# EasyEDA Pro project 遥控器PCB设计.eprj, schematic 遥控器_v2_3
Board Name: 遥控器_V2_4通道简化版; Create Date: 2025-07-19; Page Name: P1; Project Name: 遥控器PCB设计; Schematic Name: 遥控器_v2_3; Update Date: 2025-08-31; Company: 嘉立创EDA; Page Size: A4; Version: V1.0
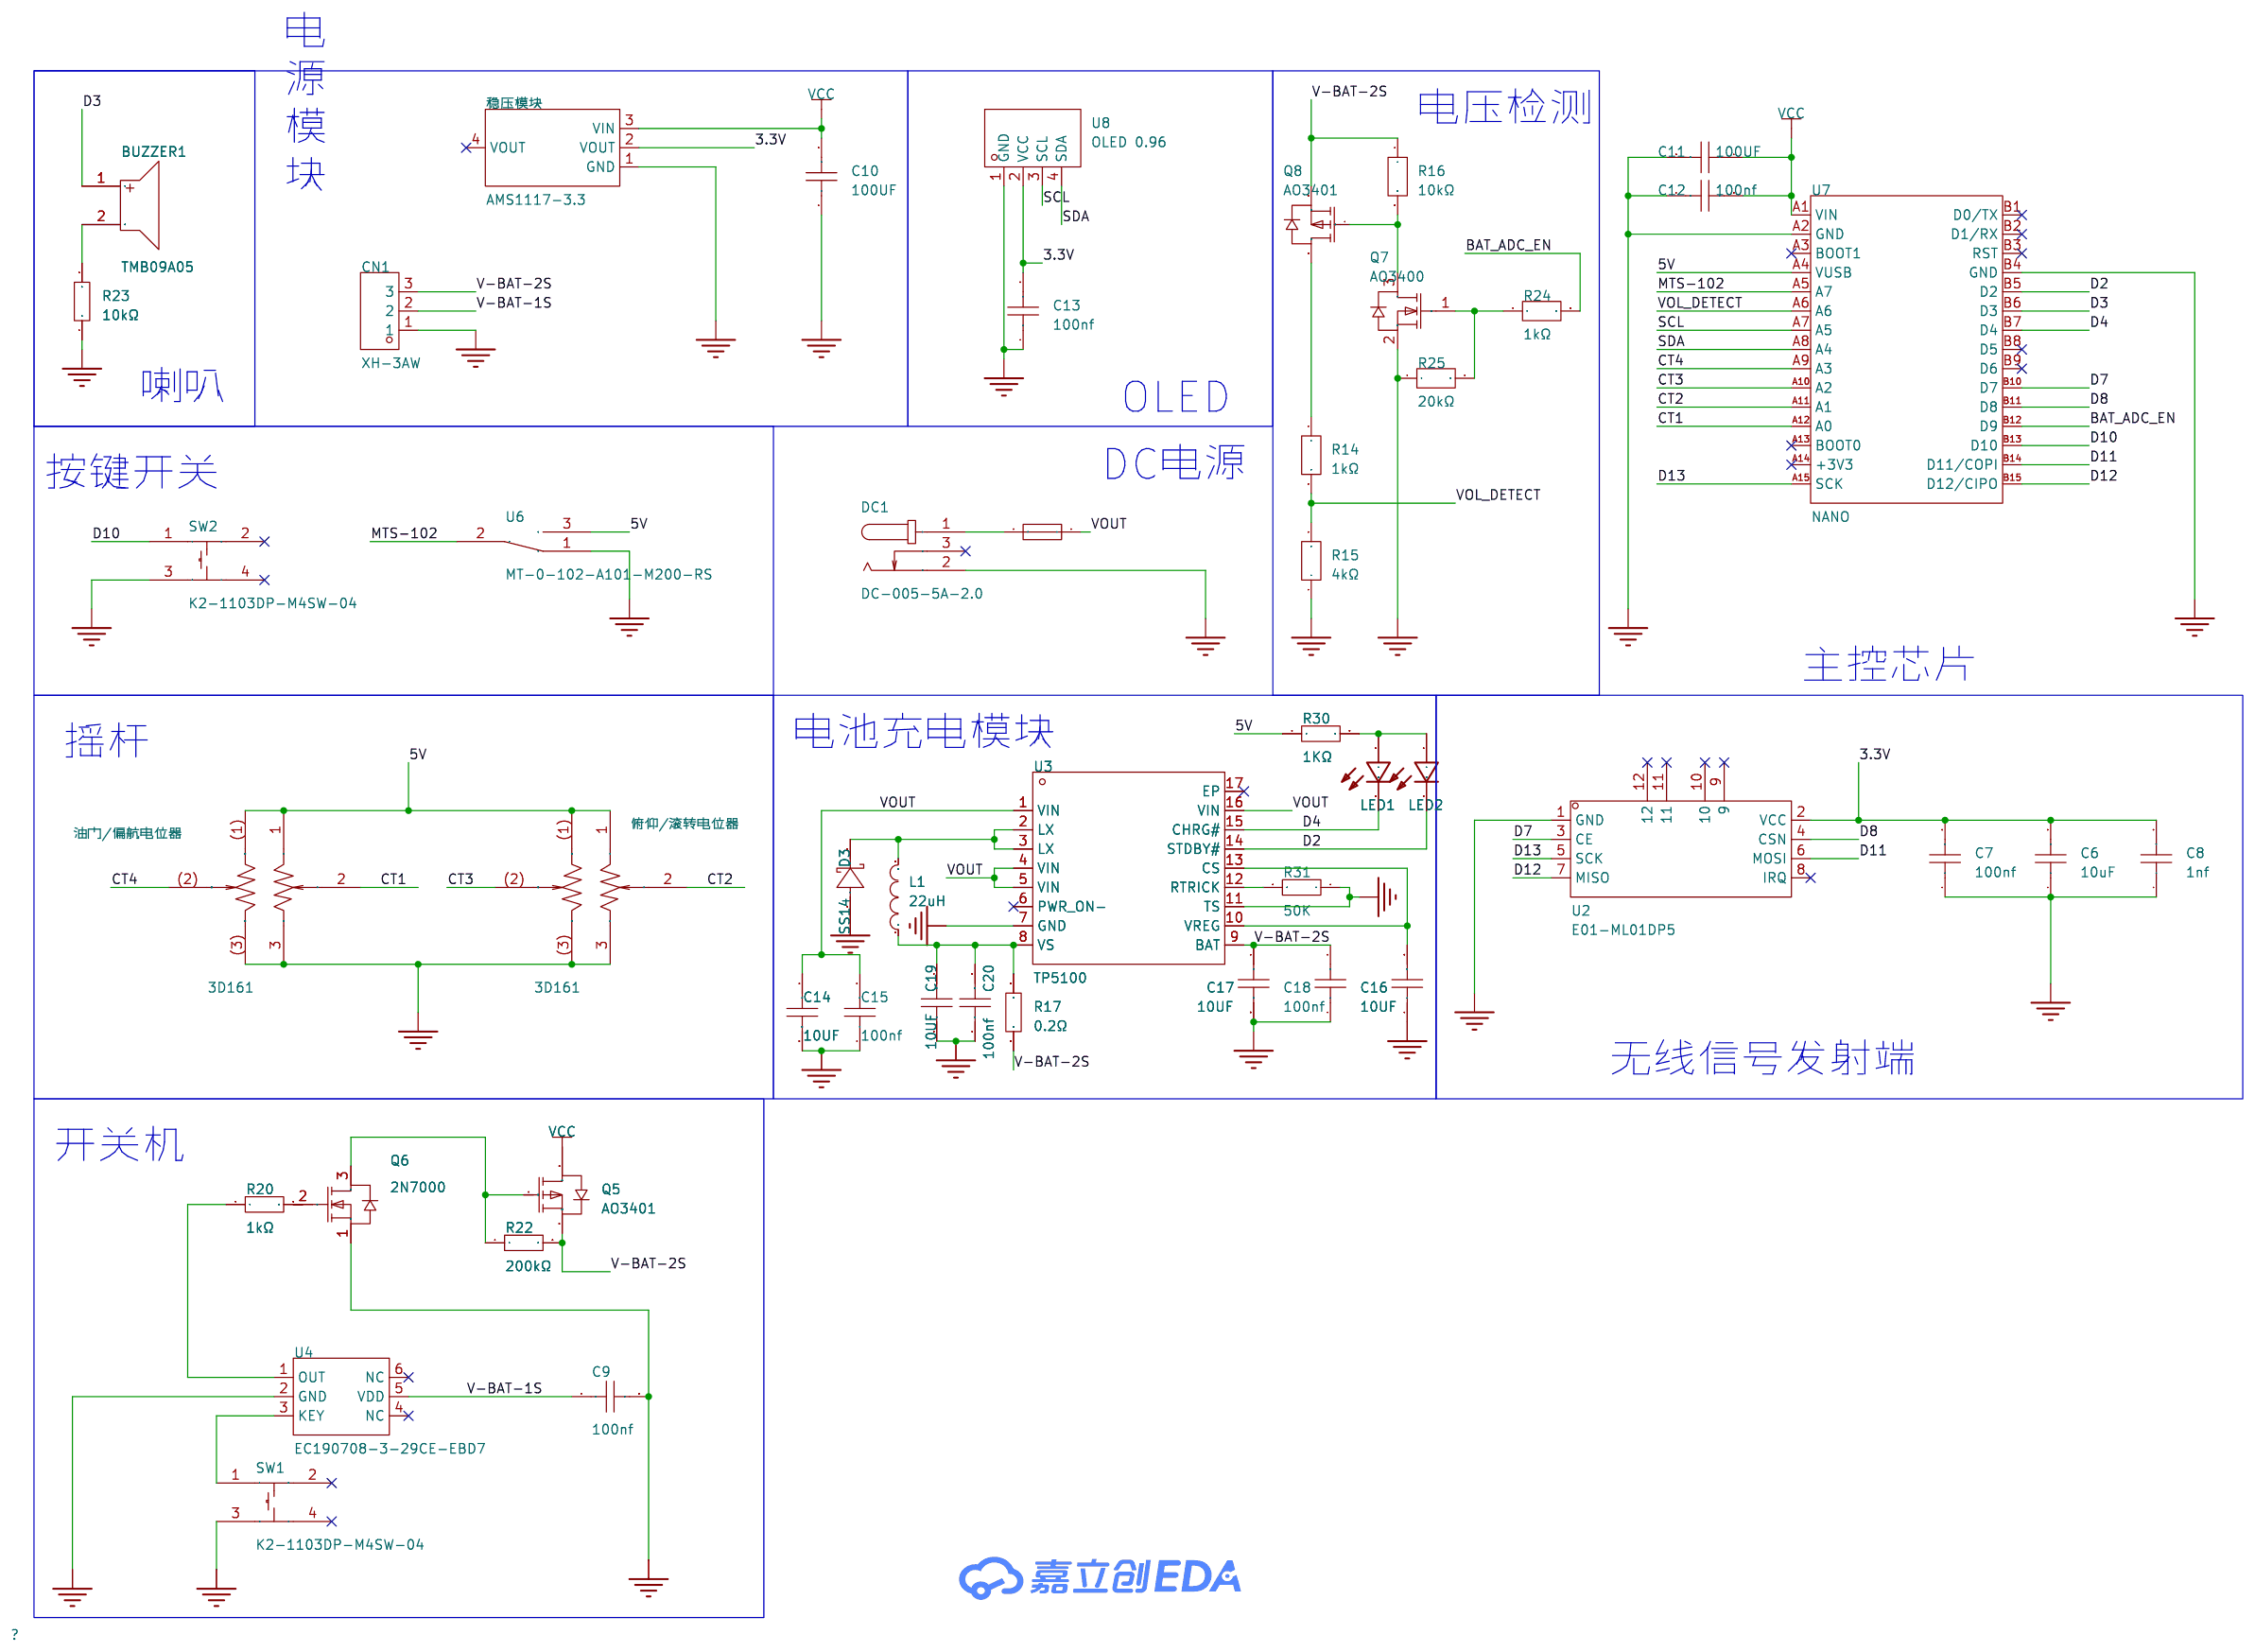
[diagram p9: schematic sheet]

## Parts
BUZZER1  TMB09A05  [BUZ-TH_BD9.0-P5.00-D0.6-L-FD]
C6  10uF  [C1206]
C7  100nf  [C1206]
C8  1nf  [C1206]
C9  100nf  [C1206]
C10  100UF  [C1210]
C11  100UF  [C1210]
C12  100nf  [C1206]
C13  100nf  [C1206]
C14  10UF  [C1210]
C15  100nf  [C1206]
C16  10UF  [C1206]
C17  10UF  [C1210]
C18  100nf  [C1206]
C19  10UF  [C1210]
C20  100nf  [C1206]
CN1  XH-3AW  [CONN-TH_3P-P2.54_HCTL_XH-3AW]
D3  SS14  [SMA_L4.3-W2.6-LS5.0-FD]
DC1  DC-005-5A-2.0  [DC-IN-TH_DC-005-5A-2.0]
F1  SMD1206  [F1206]
L1  22uH  [IND-SMD_L12.0-W12.0_YPRH120X]
LED1  19-217/BHC-ZL1M2RY/3T  [LED0603-R-RD]
LED2  19-217/BHC-ZL1M2RY/3T  [LED0603-R-RD]
Q5  AO3401  [SOT-23-3_L2.9-W1.4-P1.90-LS2.6-BR]
Q6  2N7000  [TO-92-3_L4.9-W3.7-P1.27-L]
Q7  AO3400  [SOT-23_L2.9-W1.3-P1.90-LS2.4-BR]
Q8  AO3401  [SOT-23-3_L2.9-W1.4-P1.90-LS2.6-BR]
R14  1kΩ  [R0603]
R15  4kΩ  [R0603]
R16  10kΩ  [R0603]
R17  0.2Ω  [R1206]
R20  1kΩ  [R0603]
R22  200kΩ  [R0603]
R23  10kΩ  [R0603]
R24  1kΩ  [R0603]
R25  20kΩ  [R0603]
R30  1KΩ  [R1206]
R31  50K  [R1206]
SW1  K2-1103DP-M4SW-04  [SW-TH_4P-L12.0-W12.0-P5.00-LS12.5_TC-1103XX]
SW2  K2-1103DP-M4SW-04  [SW-TH_4P-L12.0-W12.0-P5.00-LS12.5_TC-1103XX]
U2  E01-ML01DP5  [WIRELM-TH_E01-ML01DP5]
U3  TP5100  [TQFN-16_L4.0-W4.0-P0.65-BL-EP]
U4  EC190708-3-29CE-EBD7  [SOT-23-6_L2.9-W1.6-P0.95-LS2.9-BL]
U6  MT-0-102-A101-M200-RS  [SW-TH_MT-0-103-A101-M200-RS]
U7  NANO  [COMM-TH_ABX00092]
U8  OLED 0.96  [OLED-TH_L27.8-W27.2-P2.54_C9900033791]
俯仰/滚转电位器  3D161  [SW-TH_3D161]
油门/偏航电位器  3D161  [SW-TH_3D161]
稳压模块  AMS1117-3.3  [SOT-223-3_L6.5-W3.4-P2.30-LS7.0-BR]

## Library data of the parts
BUZZER1 = TMB09A05: LCSC Part Name: 蜂鸣器; Supplier Part: C49246939; Manufacturer: XHXDZ(兴华鑫); Supplier Footprint: 插件,D9xL5.5mm; JLCPCB Part Class: 扩展库; Datasheet: https://atta.szlcsc.com/upload/public/pdf/source/20250627/50F92DDAD8206418B87DF1B4D6B075D4.pdf; Supplier: LCSC
C6-C9 C12 C13 C15 C16 C18 C20 = HGC1206R5106K500NSPJ: LCSC Part Name: 10uF ±10% 50V; Supplier Part: C7432781; Manufacturer: Chinocera(华瓷); Supplier Footprint: 1206; JLCPCB Part Class: 扩展库; Datasheet: https://atta.szlcsc.com/upload/public/pdf/source/20240320/FAC3FEC40A78BC5CCCE96C232A94D860.pdf; Supplier: LCSC; Tolerance: ±10%; Voltage Rating: 50V; Temperature Coefficient: X5R
C10 C11 C14 C17 C19 = HGC1210R5476M250NSVK: LCSC Part Name: 47uF ±20% 25V; Supplier Part: C7432791; Manufacturer: Chinocera(华瓷); Supplier Footprint: 1210; JLCPCB Part Class: 扩展库; Datasheet: https://atta.szlcsc.com/upload/public/pdf/source/20240320/FAC3FEC40A78BC5CCCE96C232A94D860.pdf; Supplier: LCSC; Tolerance: ±20%; Voltage Rating: 25V; Temperature Coefficient: X5R
CN1 = XH-3AW_C2908612: LCSC Part Name: 1x3P 间距:2.54mm 弯插 系列:XH; Supplier Part: C2908612; Manufacturer: HCTL(华灿天禄); Supplier Footprint: 弯插,P=2.5mm; JLCPCB Part Class: 扩展库; Datasheet: https://atta.szlcsc.com/upload/public/pdf/source/20230711/B565BAF3B11666EF6B81B3605408F2BD.pdf; Supplier: LCSC; Pins Structure: 1x3P; Pitch: 2.54mm; Mounting Style: 弯插; Reference Series: XH; Number of Pins: 3P; Number of Rows: 1; Number of PINs Per Row: 3; Current Rating (Max): 3A; Contact Material: 黄铜; Contact Plating: 锡; Operating Temperature Range: -25℃~+85℃
D3 = SS14_C7420316: LCSC Part Name: 电压:40V 电流:1A; Supplier Part: C7420316; Manufacturer: 宏迦橙; Supplier Footprint: SMA(DO-214AC); JLCPCB Part Class: 扩展库; Datasheet: https://atta.szlcsc.com/upload/public/pdf/source/20230828/C73881E3299A0827586C2B1C18B17A53.pdf; Supplier: LCSC; Diode Configuration: 独立式; Forward Voltage (Vf@If): 550mV@1.0A; Reverse Voltage (Vr): 40V; Rectified Current: 1A; Reverse Leakage Current (Ir): 200uA@40V
DC1 = DC-005-5A-2.0: LCSC Part Name: DC电源插座 内径:2mm 外径:6.2mm; Supplier Part: C381116; Manufacturer: XKB Connection(中国星坤); Supplier Footprint: 插件; JLCPCB Part Class: 扩展库; Datasheet: https://atta.szlcsc.com/upload/public/pdf/source/20211015/707A35F7AB6E89C57AAB641950105BB7.pdf; Supplier: LCSC; Connector Type: DC电源插座; Mounting Style: 弯插; Inside Contact Diameter: 2mm; Outside Contact Diameter: 6.2mm; Current Rating (Max): 5A; Voltage Rating (Max): 24V; Operating Temperature Range: -20℃~+70℃
F1 = SMD1206-150-16: Supplier Part: C46641031; Manufacturer: 宏嘉诚; Supplier Footprint: 1206; JLCPCB Part Class: 扩展库; Datasheet: https://atta.szlcsc.com/upload/public/pdf/source/20250414/5AC46D2F961B725C9DB708C91B04DBEC.pdf; Supplier: LCSC; Voltage - Max: 16V; Current - Max: 40A; Hold Current: 1.5A; Trip Current: 3A; Power Dissipation: 1W; Resistance - Initial (Ri) (Min): 25mΩ; Resistance - Post Trip (R1) (Max): 130mΩ; Time to Trip(Max): 300ms
L1 = YPRH1207-220M: LCSC Part Name: 22uH ±20%; Supplier Part: C339950; Manufacturer: YJYCOIN(益嘉源); Supplier Footprint: SMD,12x12mm; JLCPCB Part Class: 扩展库; Datasheet: https://atta.szlcsc.com/upload/public/pdf/source/20200623/C339950_CB2CAFE108BC5DE837AA8F39C29DA454.pdf; Supplier: LCSC; Tolerance: ±20%; Rated Current: 3.6A; DC Resistance (DCR): 43mΩ
LED1 LED2 = 19-217/BHC-ZL1M2RY/3T: Supplier: LCSC; Manufacturer: EVERLIGHT; image: //image.lceda.cn/szlcsc/C72041.jpg; Supplier Part: C72041; JLCPCB Part Class: Basic; spicePre: L
Q5 Q8 = AO3401_C727156: LCSC Part Name: 1个P沟道 耐压:30V 电流:4.2A; Supplier Part: C727156; Manufacturer: TWGMC(台湾迪嘉); Supplier Footprint: SOT-23; JLCPCB Part Class: 扩展库; Datasheet: https://atta.szlcsc.com/upload/public/pdf/source/20200827/C727156_6E081BBEEFBC6B8FEE164CB196B0AF30.pdf; Supplier: LCSC; Type: 1个P沟道; Drain Source Voltage (Vdss): 30V; Continuous Drain Current (Id): 4.2A; Drain Source On Resistance (RDS(on)@Vgs,Id): 65mΩ@10V,4.2A; Power Dissipation (Pd): 350mW; Gate Threshold Voltage (Vgs(th)@Id): 1.3V@250uA; Input Capacitance (Ciss@Vds): 954pF; Reverse Transfer Capacitance (Crss@Vds): 77pF; Operating Temperature: -55℃~+150℃
Q6 = 2N7000: LCSC Part Name: 1个N沟道 耐压:60V 电流:200mA; Supplier Part: C232838; Manufacturer: onsemi(安森美); Supplier Footprint: TO-92-3; JLCPCB Part Class: 扩展库; Datasheet: https://atta.szlcsc.com/upload/public/pdf/source/20221020/6B07E43F0B4B9B39AB447A9A1885F5BD.pdf; Supplier: LCSC; Type: 1个N沟道; Drain Source Voltage (Vdss): 60V; Continuous Drain Current (Id): 200mA; Drain Source On Resistance (RDS(on)@Vgs,Id): 5Ω@10V,500mA; Power Dissipation (Pd): 400mW; Gate Threshold Voltage (Vgs(th)@Id): 3V@1mA
Q7 = AO3400_C2938367: LCSC Part Name: 1个N沟道 耐压:30V 电流:5.8A; Supplier Part: C2938367; Manufacturer: GOODWORK(固得沃克); Supplier Footprint: SOT-23; JLCPCB Part Class: 扩展库; Datasheet: https://atta.szlcsc.com/upload/public/pdf/source/20240805/AF56525E67E43DBB802F95DDDF058BE9.pdf; Supplier: LCSC; Type: 1个N沟道; Drain to Source Voltage: 30V; Current - Continuous Drain(Id): 5.8A; RDS(on): 52mΩ@2.5V,4A; Pd - Power Dissipation: 1.5W; Gate Threshold Voltage (Vgs(th)@Id): 700mV; Input Capacitance(Ciss@Vds): 1.05nF; Reverse Transfer Capacitance (Crss@Vds): 77pF; Operating Temperature: -55℃~+150℃
R14 = FRC0603F1001TS: 电阻类型:厚膜电阻;阻值:1kΩ;精度:±1%;功率:100mW;最大工作电压:75V;温度系数:±100ppm/℃;; LCSC Part Name: 1kΩ ±1% 100mW 厚膜电阻; Supplier Part: C2907002; Manufacturer: FOJAN(富捷); Supplier Footprint: 0603; JLCPCB Part Class: 扩展库; Datasheet: https://atta.szlcsc.com/upload/public/pdf/source/20211221/925EC7D7225764EE0046F22065062C87.pdf; Supplier: LCSC; Type: 厚膜电阻; Tolerance: ±1%; Power(Watts): 100mW; Overload Voltage (Max): 75V; Temperature Coefficient: ±100ppm/℃; Operating Temperature Range: -55℃~+155℃
R15 = ARG03FTC4001N: 电阻类型:薄膜电阻;阻值:4kΩ;精度:±1%;; LCSC Part Name: 4kΩ ±1%; Supplier Part: C2984443; Manufacturer: Viking(光颉); Supplier Footprint: 0603; JLCPCB Part Class: 扩展库; Datasheet: https://atta.szlcsc.com/upload/public/pdf/source/20200117/C485675_99063924B4564AF910B7BE66DA8EFA49.pdf; Supplier: LCSC; Type: 薄膜电阻; Tolerance: ±1%
R16 R24 R25 = FRC0603J103 TS: 电阻类型:厚膜电阻;阻值:10kΩ;精度:±5%;功率:100mW;工作电压:75V;温度系数:±100ppm/℃;; LCSC Part Name: 10kΩ ±5% 100mW 厚膜电阻; Supplier Part: C2930027; Manufacturer: FOJAN(富捷); Supplier Footprint: 0603; JLCPCB Part Class: 扩展库; Datasheet: https://atta.szlcsc.com/upload/public/pdf/source/20211221/925EC7D7225764EE0046F22065062C87.pdf; Supplier: LCSC; Type: 厚膜电阻; Tolerance: ±5%; Power(Watts): 100mW; Voltage-Supply(Max): 75V; Temperature Coefficient: ±100ppm/℃; Operating Temperature: -55℃~+155℃
R17 R30 R31 = 1206W4F1002T5E: LCSC Part Name: 10kΩ ±1% 250mW 厚膜电阻; Supplier Part: C17902; Manufacturer: UNI-ROYAL(厚声); Supplier Footprint: 1206; JLCPCB Part Class: 基础库; Datasheet: https://atta.szlcsc.com/upload/public/pdf/source/20200306/C422600_1E6D84923E4A46A82E41ADD87F860B5C.pdf; Supplier: LCSC; Type: 厚膜电阻; Tolerance: ±1%; Power(Watts): 250mW; Overload Voltage (Max): 200V; Temperature Coefficient: ±100ppm/℃; Operating Temperature Range: -55℃~+155℃
R20 R22 R23 = 0603WAF1002T5E: LCSC Part Name: 厚膜电阻 10kΩ ±1% 100mW; Supplier Part: C25804; Manufacturer: UNI-ROYAL(厚声); Supplier Footprint: 0603; JLCPCB Part Class: 基础库; Datasheet: https://atta.szlcsc.com/upload/public/pdf/source/20200306/C422600_1E6D84923E4A46A82E41ADD87F860B5C.pdf; Supplier: LCSC; Type: 厚膜电阻; Tolerance: ±1%; Power(Watts): 100mW; Voltage-Supply(Max): 75V; Temperature Coefficient: ±100ppm/℃; Operating Temperature: -55℃~+155℃
SW1 SW2 = K2-1103DP-M4SW-04_C136702: Supplier Part: C136702; Supplier Footprint: 12x12mm; JLCPCB Part Class: 扩展库; Supplier: LCSC
U2 = E01-ML01DP5: Supplier Part: C97339; Manufacturer: EBYTE(亿佰特); Supplier Footprint: 插件; JLCPCB Part Class: 扩展库; Datasheet: https://atta.szlcsc.com/upload/public/pdf/source/20170306/1488794685960.pdf; Supplier: LCSC
U3 = TP5100: Supplier Part: C379389; Manufacturer: TOPPOWER(南京拓微); Supplier Footprint: TQFN-16-EP(4x4); JLCPCB Part Class: 扩展库; Datasheet: https://atta.szlcsc.com/upload/public/pdf/source/20230625/310531CA6E48A76C009AF7A61C581768.pdf; Supplier: LCSC
U4 = EC190708-3-29CE-EBD7: Supplier Part: C9900183753; Supplier Footprint: SOT23-6; Supplier: LCSC
U6 = MT-0-102-A101-M200-RS: LCSC Part Name: 小型钮子三脚二档 五件套; Supplier Part: C1788492; Manufacturer: YUEN FUNG(源丰); Supplier Footprint: 插件; JLCPCB Part Class: 扩展库; Datasheet: https://atta.szlcsc.com/upload/public/pdf/source/20230720/8E5C36EFDF374AE4FF4AC09DB233CE0E.pdf; Supplier: LCSC; Circuit: 单刀双掷; Switch Length: 13mm; Switch Width: 8mm; Switch Height: 28.6mm; Contact Current: 5A; Voltage Rating (AC): 125V; Actuator Type: 圆柱钮柄; Pin Style: 焊片; Mounting Style: 直插; Operating Temperature: -25℃~+85℃
U7 = ABX00092: Supplier Part: C22392566; Manufacturer: arduino; JLCPCB Part Class: 扩展库; Datasheet: https://atta.szlcsc.com/upload/public/pdf/source/20240508/B4DB31292A327EFF3440EB84C8D7CAB2.pdf; Supplier: LCSC
U8 = HS96L03W2C03: 主控芯片:SSD1315;接口类型:I2C;尺寸(inch):0.96;像素分辨率:128x64;; LCSC Part Name: 0.96寸OLED显示屏窄白光IIC; Supplier Part: C5248080; Manufacturer: HS(汉昇); JLCPCB Part Class: 扩展库; Datasheet: https://atta.szlcsc.com/upload/public/pdf/source/20230627/763D01F79A90007632F098068C7C8AD9.pdf; Supplier: LCSC; Main Control Chip: SSD1315; Interface Type: I2C; Size: 0.96; Pixel Resolution: 128x64; Operating Temperature: -40℃~+70℃
俯仰/滚转电位器 油门/偏航电位器 = 3D161: 摇杆  多向; LCSC Part Name: 3D161  3D摇杆 自恢复; Supplier Part: C92593; Manufacturer: 韩国韩荣; Supplier Footprint: 插件,16x16mm; JLCPCB Part Class: 扩展库; Datasheet: https://atta.szlcsc.com/upload/public/pdf/source/20170523/1495534045704.pdf; Supplier: LCSC
稳压模块 = AMS1117-3.3_C6186: 输出类型:固定;工作电压:-;输出电压:3.3V;输出电流:1A;电源纹波抑制比(PSRR):72dB@(120Hz);输出极性:正极;; LCSC Part Name: 输出3.3V 1A; Supplier Part: C6186; Manufacturer: AMS; Supplier Footprint: SOT-223; JLCPCB Part Class: Basic Part; Datasheet: https://atta.szlcsc.com/upload/public/pdf/source/20180727/C6186_7A095716F0823C02F1997A905E26C086.pdf; Supplier: LCSC; Output Type: 固定; Output Voltage: 3.3V; Output Current: 1A; Power Supply Rejection Ratio (PSRR): 72dB@(120Hz); Voltage Dropout: 1.3V@(800mA); Features: 过流保护(OCP)；热关断(TSD); Output Configuration: 正极; Number of Outputs: 1

## Nets
3.3V: C6.2 C7.2 C8.2 C13.2 U2.2(VCC) U8.2(VCC) 稳压模块.2(VOUT)
5V: R30.1 U6.3 U7.A4(VUSB) 俯仰/滚转电位器.1 俯仰/滚转电位器.(1) 油门/偏航电位器.1 油门/偏航电位器.(1)
GND: C6.1 C7.1 C8.1 C9.2 C10.1 C11.2 C12.1 C13.1 C14.2 C15.1 C16.1 C17.2 C18.1 C19.2 C20.1 CN1.1 D3.1(A) DC1.2 Q6.1(S) Q7.2(S) R15.1 R23.1 R25.1 R31.1 SW1.3 SW2.3 U2.1(GND) U3.7(GND) U3.11(TS) U4.2(GND) U6.1 U7.A2(GND) U7.B4(GND) U8.1(GND) 俯仰/滚转电位器.3 俯仰/滚转电位器.(3) 油门/偏航电位器.3 油门/偏航电位器.(3) 稳压模块.1(GND)
VCC: C10.2 C11.1 C12.2 Q5.3(D) U7.A1(VIN) 稳压模块.3(VIN)
BAT_ADC_EN: R24.2 U7.B12(D9)
CT1: U7.A12(A0) 油门/偏航电位器.2
CT2: U7.A11(A1) 俯仰/滚转电位器.2
CT3: U7.A10(A2) 俯仰/滚转电位器.(2)
CT4: U7.A9(A3) 油门/偏航电位器.(2)
D2: LED2.2(C) U3.14(STDBY#) U7.B5(D2)
D3: BUZZER1.1 U7.B6(D3)
D4: LED1.2(C) U3.15(CHRG#) U7.B7(D4)
D7: U2.3(CE) U7.B10(D7)
D8: U2.4(CSN) U7.B11(D8)
D10: SW2.1 U7.B13(D10)
D11: U2.6(MOSI) U7.B14(D11/COPI)
D12: U2.7(MISO) U7.B15(D12/CIPO)
D13: U2.5(SCK) U7.A15(SCK)
MTS-102: U6.2 U7.A5(A7)
SCL: U7.A7(A5) U8.3(SCL)
SDA: U7.A8(A4) U8.4(SDA)
V-BAT-1S: C9.1 CN1.2 U4.5(VDD)
V-BAT-2S: C17.1 C18.2 CN1.3 Q5.2(S) Q8.2(S) R16.1 R17.1 R22.2 U3.9(BAT)
VOL_DETECT: R14.2 R15.2 U7.A6
VOUT: C14.1 C15.2 F1.1 U3.1(VIN) U3.4(VIN) U3.5(VIN) U3.16(VIN)
$1N7039: BUZZER1.2 R23.2
$1N15638: Q7.3(D) Q8.1(G) R16.2
$1N17281: D3.2(K) L1.2 U3.2(LX) U3.3(LX)
$1N17670: C16.2 U3.10(VREG) U3.13(CS)
$1N19161: R20.1 U4.1(OUT)
$1N19164: SW1.1 U4.3(KEY)
$1N21691: Q5.1(G) Q6.3(D) R22.1
$1N22503: C19.1 C20.2 L1.1 R17.2 U3.8(VS)
$1N22739: Q7.1(G) R24.1 R25.2
$1N25511: Q6.2(G) R20.2
$1N25526: Q8.3(D) R14.1
$1N34710: LED1.1(A) LED2.1(A) R30.2
$1N34766: R31.2 U3.12(RTRICK)
$1N35223: DC1.1 F1.2

Not connected (* = marked no-connect by the designer): DC1 3*; SW1 2* 4*; SW2 2* 4*; U2 8(IRQ)* 9* 10* 11* 12*; U3 6(PWR_ON-)* 17(EP)*; U4 4(NC)* 6(NC)*; U7 A3(BOOT1)* A13(BOOT0)* A14(+3V3)* B1(D0/TX)* B2(D1/RX)* B3(RST)* B8(D5)* B9(D6)*; 稳压模块 4(VOUT)*

## Notes on the sheet
- 电压检测
- 电
  源
  模
  块
- 喇叭
- OLED
- 按键开关
- DC电源
- 主控芯片
- 摇杆
- 电池充电模块
- 无线信号发射端
- 开关机
